# Altium project CheckinGate.PrjPcb
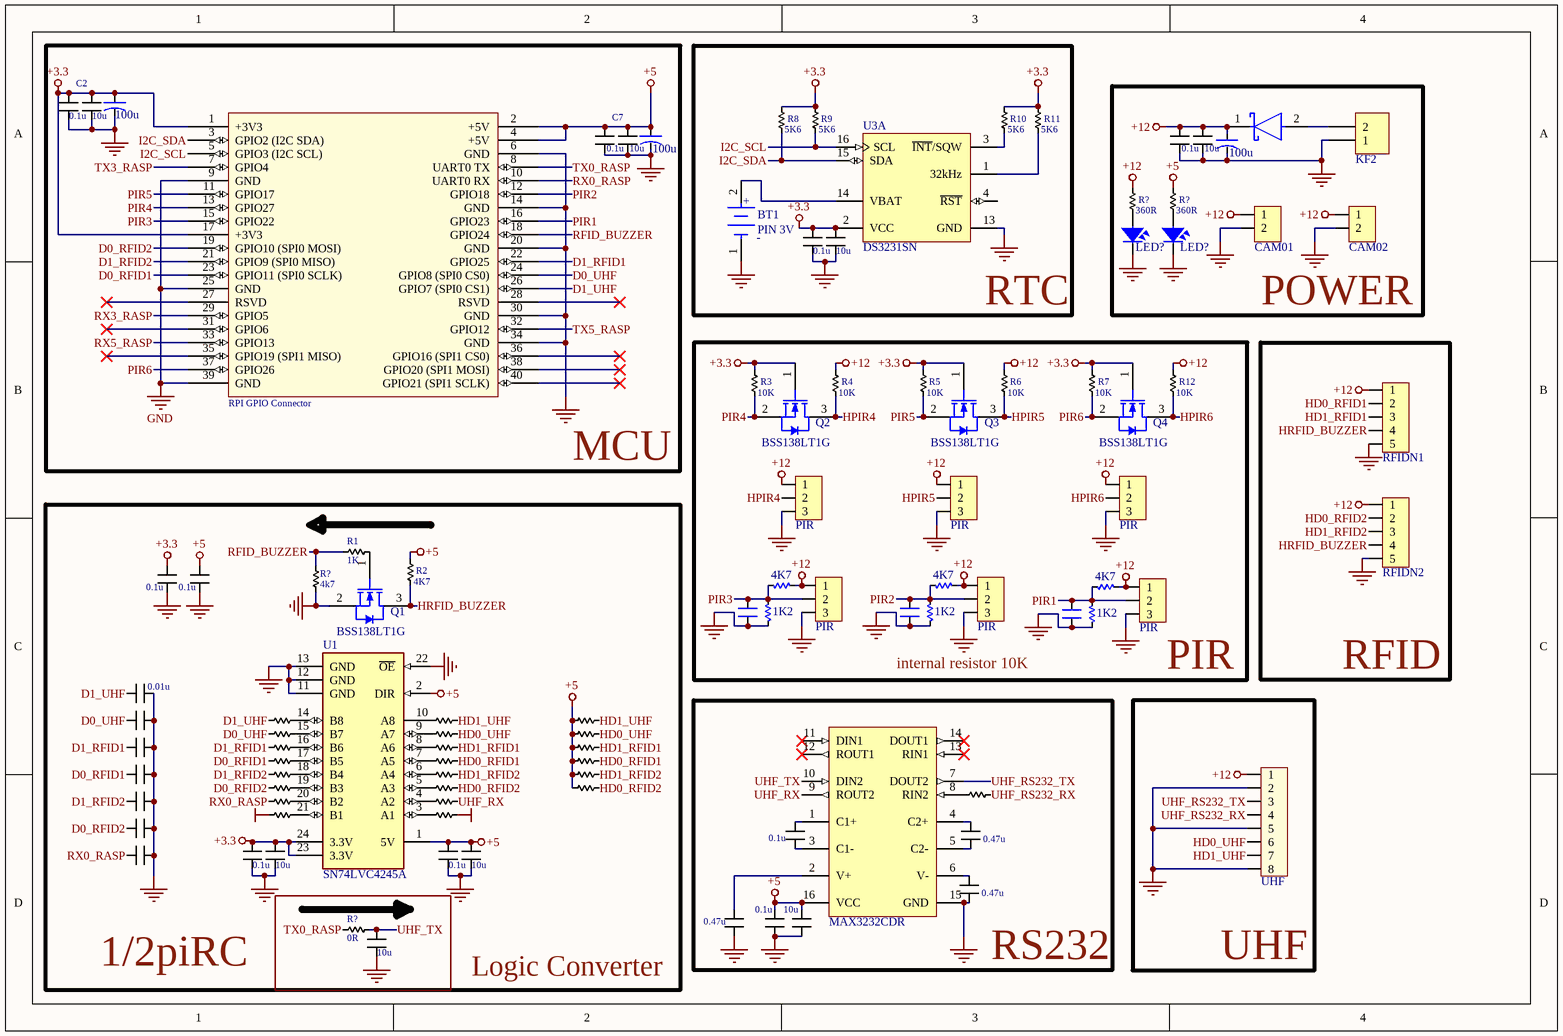
[diagram p0: CheckinGate.SchDoc]
mProjectAuthor: Nils Minor; mProjectName: RPI BOARD; mProjectRevision: 0; mProjectVersion: 1
1 sheet, 103 parts. Net scope: global (net labels, ports and power ports of the same name join across sheets).
Board file: CheckinGate.PcbDoc

## Sheet CheckinGate.SchDoc
size A4; SheetNumber: 1; SheetTotal: 1

### Parts
(Parts that share a designator on the sheet are numbered #1, #2 ... from top to bottom, then left to right.)
BT1  PIN 3V  [FP-BU2032SM-HD-G-MFG]
C1  100u  [CAP-ALU-SMD-6.3x7.7x2.2]
C2  10u  [CN-SMD-0805]
C3  10u  [CN-SMD-0805]
C4  0.1u  [CN-SMD-0805]
C5  0.1u  [CN-SMD-0805]
C6  100u  [CA-ALU-6.3]
C7  10u  [CN-SMD-0805]
C8  0.1u  [CN-SMD-0805]
C9  100u  [CAP-ALU-SMD-6.3x7.7x2.2]
C10  10u  [CN-SMD-0805]
C11  0.1u  [CN-SMD-0805]
C12  0.1u  [CN-SMD-0805]
C13  0.1u  [CN-SMD-0805]
C18  PIR  [HDR3]
C19  PIR  [HDR3]
C20  PIR  [HDR3]
C21  PIR  [HDR3]
C22  PIR  [HDR3]
C23  0.01u  [CN-SMD-0805]
C24  0.01u  [CN-SMD-0805]  (value not drawn)
C25  0.01u  [CN-SMD-0805]  (value not drawn)
C26  0.01u  [CN-SMD-0805]  (value not drawn)
C27  0.01u  [CN-SMD-0805]  (value not drawn)
C28  0.01u  [CN-SMD-0805]  (value not drawn)
C29  0.01u  [CN-SMD-0805]  (value not drawn)
C31  0.1u  [CN-SMD-0805]
C32  10u  [CN-SMD-0805]
C33  0.1u  [CN-SMD-0805]
C34  10u  [CN-SMD-0805]
C38  104  [CN-SMD-0805]  (value not drawn)
C39  104  [CN-SMD-0805]  (value not drawn)
C40  PIR  [HDR3]
C41  104  [CN-SMD-0805]  (value not drawn)
C44  0.1u  [CN-SMD-0805]
C45  0.47u  [CN-SMD-0805]
C48  0.47u  [CN-SMD-0805]
C49  0.47u  [CN-SMD-0805]
C50  0.1u  [CN-SMD-0805]
C51  10u  [CN-SMD-0805]
C?  10u  [CN-SMD-0805]
D2  SS34-E3/57T  [FP-95402-MFG]  (value not drawn)
J1  KF2  [KF2-5.08]
JP2  RFIDN1  [Header5]
JP3  RFIDN2  [Header5]
JP4  UHF  [Header8]
JP?#1  CAM01  [Header2]
JP?#2  CAM02  [Header2]
LED?#1  LED  [LED-0805-Green]  (value not drawn)
LED?#2  LED  [LED-0805-Red]  (value not drawn)
Q1  BSS138LT1G  [ONSC-SOT-23-3-318-08_V]
Q2  BSS138LT1G  [ONSC-SOT-23-3-318-08_V]
Q3  BSS138LT1G  [ONSC-SOT-23-3-318-08_V]
Q4  BSS138LT1G  [ONSC-SOT-23-3-318-08_V]
R1  1K  [RES-SMD-0805]
R2  4K7  [RES-SMD-0805]
R3  10K  [RES-SMD-0805]
R4  10K  [RES-SMD-0805]
R5  10K  [RES-SMD-0805]
R6  10K  [RES-SMD-0805]
R7  10K  [RES-SMD-0805]
R8  5K6  [RES-SMD-0805]
R9  5K6  [RES-SMD-0805]
R10  5K6  [RES-SMD-0805]
R11  5K6  [RES-SMD-0805]
R12  10K  [RES-SMD-0805]
R13  1M  [RES-SMD-0805]  (value not drawn)
R14  1M  [RES-SMD-0805]  (value not drawn)
R15  100R  [RES-SMD-0805]  (value not drawn)
R16  100R  [RES-SMD-0805]  (value not drawn)
R17  100R  [RES-SMD-0805]  (value not drawn)
R18  100R  [RES-SMD-0805]  (value not drawn)
R19  100R  [RES-SMD-0805]  (value not drawn)
R20  100R  [RES-SMD-0805]  (value not drawn)
R21  100R  [RES-SMD-0805]  (value not drawn)
R22  100R  [RES-SMD-0805]  (value not drawn)
R23  100R  [RES-SMD-0805]  (value not drawn)
R24  100R  [RES-SMD-0805]  (value not drawn)
R25  100R  [RES-SMD-0805]  (value not drawn)
R26  100R  [RES-SMD-0805]  (value not drawn)
R27  100R  [RES-SMD-0805]  (value not drawn)
R28  100R  [RES-SMD-0805]  (value not drawn)
R29  1M  [RES-SMD-0805]  (value not drawn)
R30  1M  [RES-SMD-0805]  (value not drawn)
R31  1M  [RES-SMD-0805]  (value not drawn)
R32  4K7  [RES-SMD-0805]
R33  4K7  [RES-SMD-0805]
R35  100R  [RES-SMD-0805]  (value not drawn)
R36  1M  [RES-SMD-0805]  (value not drawn)
R39  1K2  [RES-SMD-0805]
R40  1K2  [RES-SMD-0805]
R41  4K7  [RES-SMD-0805]
R42  1K2  [RES-SMD-0805]
R45  1M  [RES-SMD-0805]  (value not drawn)
R?#1  360R  [RES-SMD-0805]
R?#2  360R  [RES-SMD-0805]
R?#3  4k7  [RES-SMD-0805]
R?#4  100R  [RES-SMD-0805]  (value not drawn)
R?#5  0R  [RES-SMD-0805]
RPI1  RPI GPIO Connector  [rpi]
U1  SN74LVC4245A  [SN74LVC4245-TSSOP24_R-PDSO-G24_0]
U2  MAX3232CDR  [D0016A_M]
U3  DS3231SN  [W16-H2_M]  (part A of 2)

### Blocks framed on the sheet
MCU: C1 C2 C4 C7-C9 RPI1
RTC: BT1 C10 C12 R8-R11 U3
POWER: C3 C5 C6 D2 J1 JP?#1 JP?#2 LED?#1 LED?#2 R?#1 R?#2
PIR: C18-C22 C38-C41 Q2-Q4 R3-R7 R12 R32 R33 R39-R42
RFID: JP2 JP3
1/2piRC: C11 C13 C23-C29 C31-C34 C? Q1 R1 R2 R13-R31 R35 R36 R?#3-R?#5 U1
RS232: C44 C45 C48-C51 R45 U2
UHF: JP4

### Nets
+3.3: C1.1 C2.1 C4.2 C10.1 C11.1 C12.1 C31.1 C32.1 Q2.1(G) Q3.1(G) Q4.1(G) R3.1 R5.1 R7.1 R8.1 R9.1 R10.1 R11.1 RPI1.1(+3V3) RPI1.17(+3V3) U1.23(3.3V) U1.24(3.3V) U3.2(VCC)
+5: C7.1 C8.2 C9.1 C13.1 C33.1 C34.1 C50.1 C51.1 R2.1 R13.1 R14.1 R29.1 R30.1 R31.1 R36.1 R?#2.1 RPI1.2(+5V) RPI1.4(+5V) U1.1(5V) U1.2(DIR) U2.16(VCC)
+12: C3.1 C5.2 C6.1 C18.1 C19.1 C20.1 C21.1 C22.1 C40.1 D2.1(C) JP2.1 JP3.1 JP4.1 JP?#1.1 JP?#2.1 R4.1 R6.1 R12.1 R32.1 R33.1 R41.1 R?#1.1
GND: BT1.1(C) C1.2 C2.2 C3.2 C4.1 C5.1 C6.2 C7.2 C8.1 C9.2 C10.2 C11.2 C12.2 C13.2 C18.3 C19.3 C20.3 C21.3 C22.3 C23.2 C24.2 C25.2 C26.2 C27.2 C28.2 C29.2 C31.2 C32.2 C33.2 C34.2 C38.1 C39.1 C40.3 C41.1 C48.2 C49.2 C50.2 C51.2 C?.2 J1.1 JP2.5 JP3.5 JP4.2 JP4.5 JP4.8 JP?#1.2 JP?#2.2 LED?#1.2 LED?#2.2 Q1.2(S) R18.2 R39.2 R40.2 R42.2 R?#3.2 R?#4.1 RPI1.6(GND) RPI1.9(GND) RPI1.14(GND) RPI1.20(GND) RPI1.25(GND) RPI1.30(GND) RPI1.34(GND) RPI1.39(GND) U1.11(GND) U1.12(GND) U1.13(GND) U1.22(~{OE}) U2.15(GND) U3.13(GND)
D0_RFID1: C26.1 R21.1 RPI1.23(GPIO11_(SPI0_SCLK))
D0_RFID2: C28.1 R25.1 RPI1.19(GPIO10_(SPI0_MOSI))
D0_UHF: C24.1 R17.1 RPI1.24(GPIO8_(SPI0_CS0))
D1_RFID1: C25.1 R19.1 RPI1.22(GPIO25)
D1_RFID2: C27.1 R23.1 RPI1.21(GPIO9_(SPI0_MISO))
D1_UHF: C23.1 R15.1 RPI1.26(GPIO7_(SPI0_CS1))
HD0_RFID1: JP2.2 R30.2 R35.2
HD0_RFID2: JP3.2 R26.2 R36.2
HD0_UHF: JP4.6 R14.2 R22.2
HD1_RFID1: JP2.3 R28.2 R29.2
HD1_RFID2: JP3.3 R24.2 R31.2
HD1_UHF: JP4.7 R13.2 R20.2
HPIR4: C20.2 Q2.3(D) R4.2
HPIR5: C19.2 Q3.3(D) R6.2
HPIR6: C18.2 Q4.3(D) R12.2
HRFID_BUZZER: JP2.4 JP3.4 Q1.3(D) R2.2
I2C_SCL: R9.2 RPI1.5(GPIO3_(I2C_SCL)) U3.16(SCL)
I2C_SDA: R8.2 RPI1.3(GPIO2_(I2C_SDA)) U3.15(SDA)
PIR1: C22.2 C39.2 R33.2 R40.1 RPI1.16(GPIO23)
PIR2: C40.2 C41.2 R41.2 R42.1 RPI1.12(GPIO18)
PIR3: C21.2 C38.2 R32.2 R39.1 RPI1.15(GPIO22)
PIR4: Q2.2(S) R3.2 RPI1.13(GPIO27)
PIR5: Q3.2(S) R5.2 RPI1.11(GPIO17)
PIR6: Q4.2(S) R7.2 RPI1.37(GPIO26)
RFID_BUZZER: R1.1 R?#3.1 RPI1.18(GPIO24)
RX0_RASP: C29.1 R27.1 RPI1.10(UART0_RX)
RX3_RASP: RPI1.29(GPIO5)
RX5_RASP: RPI1.33(GPIO13)
TX0_RASP: R?#5.1 RPI1.8(UART0_TX)
TX3_RASP: RPI1.7(GPIO4)
TX5_RASP: RPI1.32(GPIO12)
UHF_RS232_RX: JP4.4 R45.2
UHF_RS232_TX: JP4.3 U2.7(DOUT2)
UHF_RX: R16.2 U2.9(ROUT2)
UHF_TX: C?.1 R?#5.2 U2.10(DIN2)
NetBT1_2: BT1.2(A) U3.14(VBAT)
NetC44_1: C44.1 U2.1(C1+)
NetC44_2: C44.2 U2.3(C1-)
NetC45_1: C45.1 U2.4(C2+)
NetC45_2: C45.2 U2.5(C2-)
NetC48_1: C48.1 U2.6(V-)
NetC49_1: C49.1 U2.2(V+)
NetD2_2: D2.2(A) J1.2
NetLED?#1_1: LED?#1.1 R?#1.2
NetLED?#2_1: LED?#2.1 R?#2.2
NetQ1_1: Q1.1(G) R1.2
NetR10_2: R10.2 U3.3(~{INT}/SQW)
NetR11_2: R11.2 U3.1(32kHz)
NetR15_2: R15.2 U1.14(B8)
NetR16_1: R16.1 U1.4(A2)
NetR17_2: R17.2 U1.15(B7)
NetR18_1: R18.1 U1.3(A1)
NetR19_2: R19.2 U1.16(B6)
NetR20_1: R20.1 U1.10(A8)
NetR21_2: R21.2 U1.17(B5)
NetR22_1: R22.1 U1.9(A7)
NetR23_2: R23.2 U1.18(B4)
NetR24_1: R24.1 U1.6(A4)
NetR25_2: R25.2 U1.19(B3)
NetR26_1: R26.1 U1.5(A3)
NetR27_2: R27.2 U1.20(B2)
NetR28_1: R28.1 U1.8(A6)
NetR35_1: R35.1 U1.7(A5)
NetR45_1: R45.1 U2.8(RIN2)
NetR?#4_2: R?#4.2 U1.21(B1)

Not connected (* = marked no-connect by the designer): RPI1 27(RSVD)* 28(RSVD)* 31(GPIO6)* 35(GPIO19_(SPI1_MISO))* 36(GPIO16_(SPI1_CS0))* 38(GPIO20_(SPI1_MOSI))* 40(GPIO21_(SPI1_SCLK))*; U2 11(DIN1)* 12(ROUT1)* 13(RIN1)* 14(DOUT1)*; U3 4(~{RST})

### Notes on the sheet
- internal resistor 10K
- (near C49) Logic Converter
- (in symbol CMP-136216-000005-1) +; -

### Library data of the parts
BT1 = CMP-136216-000005-1: BATTERY HOLDER COIN 20MM SMD; Number of Cells: 1; Termination: SMD/SMT; Min Operating Temperature: -40°C; Case/Package: SMD/SMT; Diameter: 20mm; Package Quantity: 1; Lead Free: Lead Free; Mount: Surface Mount; Packaging: Cut Tape; Max Operating Temperature: 280°C
C1 C6 C9 = CN-ALU-SMD: Polarized Capacitor (Axial); Published: 8-Jun-2000; LatestRevisionDate: 17-Jul-2002; LatestRevisionNote: Re-released for DXP Platform.; PackageReference: POLAR0.8; Publisher: Altium Limited
C2-C5 C7 C8 C10-C13 C23-C29 C31-C34 C44 C45 C48-C51 C? = CAP
C18-C22 C40 = Header3: Header IDC, 3 x 1 Pin Vertical 2.54mm Pitch (Non-Boxed, Male); Manufacturer: W¨¹rth Elektronik eiSos GmbH; partNo: 613002143121; ComponentLink1 Description: Manufacturer; ComponentLink2 Description: Datasheet; NoPins: 02; Created Date: 29 March 2013; ComponentLink1URL: http://www.we-online.com; ComponentLink2URL: http://katalog.we-online.de/em/datasheet/6130xx143121.pdf; Created by: Karrer Zheng
C38 C39 C41 = CN: Value: 33pF
D2 = CMP-02539-000012-1: DIODE SCHOTTKY 40V 3A DO214AB; Manufacturer: Vishay; Max Junction Temp: +150°C; Peak Reverse Current: 0.5mA; Max Surge Forward Current: 100A; Standoff Height: 0mm; ComponentLink2Description: Datasheet; Device Class L3: Schottky Diodes; Height: 2.62mm; Max Repetitive Reverse Voltage: 40V; Lead Free: Yes; Package: 95402; Temperature Range High: +150°C; ComponentLink2URL: http://www.vishay.com/docs/88751/ss32.pdf; Temperature: -55°C to +150°C; Footprint Url: http://www.vishay.com/docs/95402/smc.pdf; Automotive: No; Forward Current: 3A; Category: Diode; Manufacturer Part Number: SS34-E3/57T; RoHS: TRUE; Device Class L2: Diodes; Mouser Description: Schottky Diodes & Rectifiers 3.0 Amp 40 Volt; Octopart: https://octopart.com/ss34-e3%2F57t-vishay-39552907; Temperature Range Low: -55°C; Device Class L1: Discrete Semiconductors; Digikey Description: DIODE SCHOTTKY 40V 3A DO214AB
J1 = KF2: Manufacturer: Würth Elektronik eiSos GmbH; partNo: 691103110002; ComponentLink1 Description: Manufacturer; ComponentLink2 Description: Datasheet; NoPins: 2; Created Date: 29 October 2013; ComponentLink1URL: http://www.we-online.com; ComponentLink2URL: http://katalog.we-online.de/em/datasheet/6911031100xx.pdf; Created by: Karrer Zheng
JP2 JP3 = Header5: Header IDC, 5 x 1 Pin Vertical 2.54mm Pitch (Non-Boxed, Male); Manufacturer: W¨¹rth Elektronik eiSos GmbH; partNo: 613002143121; ComponentLink1 Description: Manufacturer; ComponentLink2 Description: Datasheet; NoPins: 02; Created Date: 29 March 2013; ComponentLink1URL: http://www.we-online.com; ComponentLink2URL: http://katalog.we-online.de/em/datasheet/6130xx143121.pdf; Created by: Karrer Zheng
JP4 = Header8: Connector 8; Value: Connector 8
JP?#1 JP?#2 = Header2: Header IDC, 2 x 1 Pin Vertical 2.54mm Pitch (Non-Boxed, Male); Manufacturer: W¨¹rth Elektronik eiSos GmbH; partNo: 613002143121; ComponentLink1 Description: Manufacturer; ComponentLink2 Description: Datasheet; NoPins: 02; Created Date: 29 March 2013; ComponentLink1URL: http://www.we-online.com; ComponentLink2URL: http://katalog.we-online.de/em/datasheet/6130xx143121.pdf; Created by: Karrer Zheng
LED?#1 LED?#2 = LED SMD: Value: LED 3 - 5 ly 2 Colour
Q1-Q4 = CMP-1058-00767-1: Power MOSFET, 200 mA, 50 V, N-Channel, 3-Pin SOT-23, Pb-Free, Tape and Reel; Manufacturer: On Semiconductor; PD Max (W): 0.225; Coss Typ (pF): 12; V(BR)DSS Min (V): 50; VGS Max (V): 20; Channel Polarity: N Channel; Configuration: Single; VGS(th) Max (V): 1.5; Ciss Typ (pF): 40; Crss Typ (pF): 3.5; ID Max (A): 0.2; ComponentLink3Description: Package Specification; PackageDescription: 3-Pin Small Outline Transistor, Body 2.92 x 1.3 mm, Pitch 0.95 mm; PackageReference: SOT-23-3-318-08; RoHS: Pb-Free; Mounting Technology: Surface Mount; ComponentLink1Description: Manufacturer URL; ComponentLink2URL: http://www.onsemi.com/pub_link/Collateral/BSS138LT1-D.PDF; ComponentLink2Description: Datasheet; Packing: Tape and Reel; PackageVersion: Rev. AP, 11/2009; PartNumber: BSS138LT1G; Package Type: SOT-23-3; ComponentLink1URL: http://www.onsemi.com/; DatasheetVersion: Rev. 8; ComponentLink3URL: http://www.onsemi.cn/pub_link/Collateral/318-08.PDF
R1-R31 R35 R36 R45 R?#1-R?#5 = RES
R32 R33 R39-R42 = Res: Manufacturer: Generic Components; Class: Passive; SubClass: R; Published: 08/06/2000; Publisher: Altium Hobart Technology Centre
RPI1 = rpi connector: GPIO Header for Raspberry Pi A+/B+/Pi 2/Pi 3 - 2x20; Manufacturer: SparkFun Electronics; Manufacturer Part Number: PRT-14017; Nils Minor: author; nilsminor@web.de: mail; RoHS: RoHS Compliant; Category: Development Boards, Kits, Programmers; Stock 1: 150; Pricing 1: 1=1.84 (EUR); Part Status: Active; Accessory Type: Connector; For Use With/Related Products: Raspberry Pi; ComponentLink1URL: https://cdn.sparkfun.com/datasheets/Dev/RaspberryPi/12313.pdf; ComponentLink1Description: https://cdn.sparkfun.com/datasheets/Dev/RaspberryPi/12313.pdf; Supplier 1: Digi-Key; Supplier Part Number 1: 1568-1462-ND
U1 = SN74LVC4245A: SN74LVC4245A Octal Bus Transceiver and 3.3-V to 5-V Shifter With 3-State Outputs
U2 = CMP-0299-00399-2: 3-V to 5.5-V Multichannel RS-232 Line Driver / Receiver with ±15-kV ESD Protection, 0 to 70 degC, 16-Pin SOIC (D), Green (RoHS & no Sb/Br); Receivers Per Package: 2; ESD HBM(kV): +/-15; ICC(Max)(mA): 1; Supply Voltage(s)(V): 3.3 or 5.0; Single Supply: TRUE; ComponentLink1URL: www.ti.com; ComponentLink3URL: http://www.ti.com/litv/pdf/mpds178g; PackageReference: D0016A; ComponentLink2Description: Datasheet; ComponentLink2URL: http://www.ti.com/general/docs/lit/getliterature.tsp?genericPartNumber=MAX3232&fileType=pdf; ComponentLink1Description: Manufacturer URL; PackageDescription: 16-Pin Plastic Small Outline Integrated Circuit, 9.9 x 3.9 mm, Pitch 1.27 mm Pitch; PackageVersion: revM, Jun-2011; Drivers Per Package: 2; SubFamily: RS-232; DatasheetVersion: SLLS410I; ComponentLink3Description: Package Specification; RS-232: TRUE
U3 = CMP-0254-00293-1: Extremely Accurate I2C-Integrated Real-Time Clock/TCXO/Crystal, 16-Pin SO, -40 to 85 degC; ComponentLink1Description: Manufacturer URL; ComponentLink3URL: http://pdfserv.maxim-ic.com/package_dwgs/21-0042.PDF; ComponentLink3Description: Package Specification; PackageVersion: revD, 2010; ComponentLink2URL: http://datasheets.maxim-ic.com/en/ds/DS3231.pdf; ComponentLink2Description: Datasheet; PackageReference: W16-H2; Code_JEDEC: MS-013-AA; ComponentLink1URL: http://www.maxim-ic.com; PackageDescription: 16-Pin Small-Outline IC, Wide (0.3in), 1.27 mm Pitch, SOIC (W); Code_IPC: SOIC127P1030-16; DatasheetVersion: Rev 8, Jul-2010

## Assembly variants
default: all parts fitted